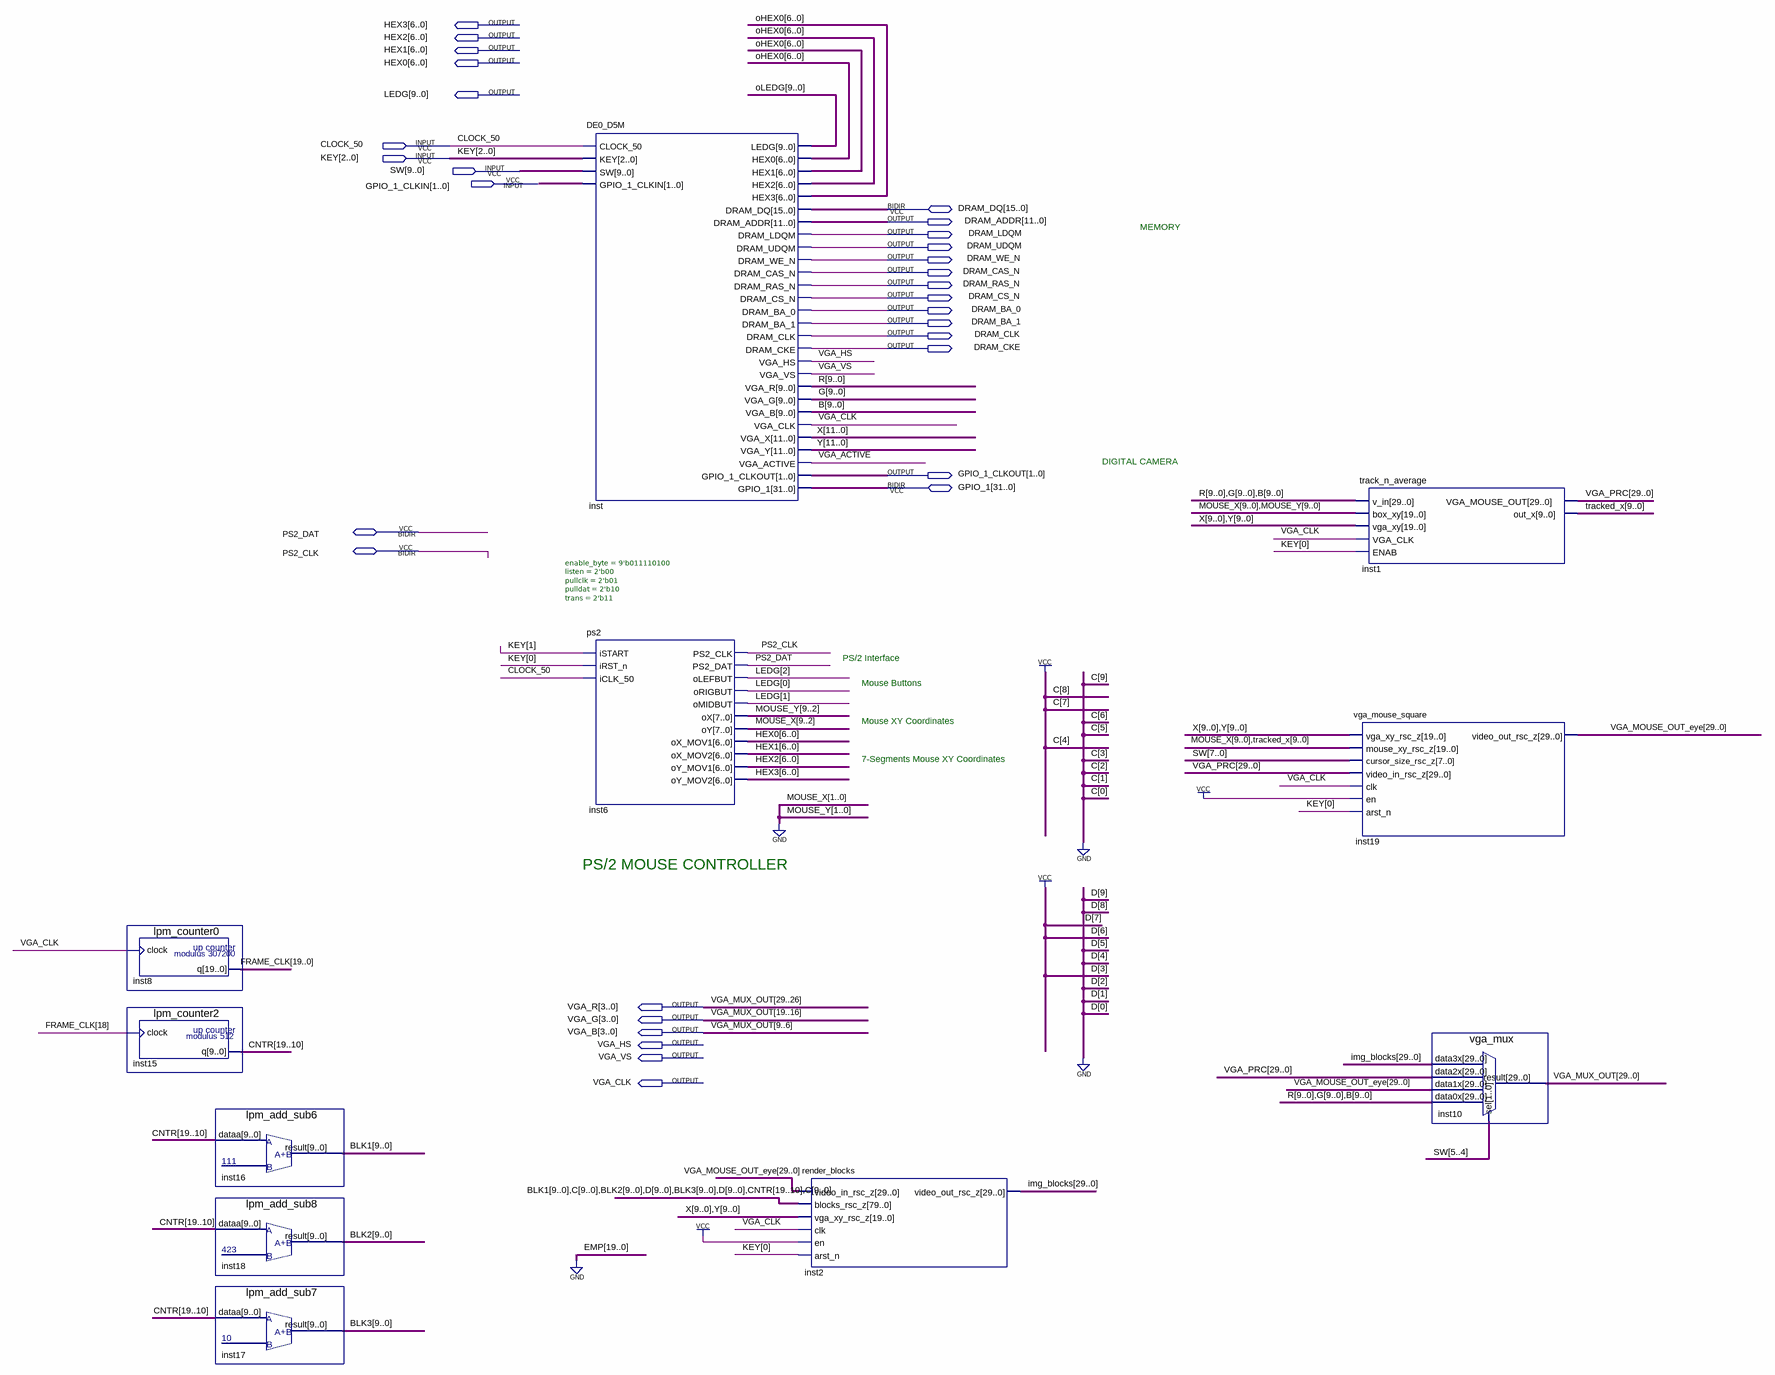
[diagram p0: schematic sheet]
// Quartus schematic TOP_DE0_CAMERA_MOUSE.bdf as structural Verilog: 11 symbols, 31 pins
module TOP_DE0_CAMERA_MOUSE (
  input  CLOCK_50,
  input  [2:0] KEY,
  input  [9:0] SW,
  input  [1:0] GPIO_1_CLKIN,
  inout  [15:0] DRAM_DQ,
  inout  [31:0] GPIO_1,
  inout  PS2_DAT,
  inout  PS2_CLK,
  output [6:0] HEX3,
  output [6:0] HEX2,
  output [6:0] HEX1,
  output [6:0] HEX0,
  output [9:0] LEDG,
  output [11:0] DRAM_ADDR,
  output DRAM_LDQM,
  output DRAM_UDQM,
  output DRAM_WE_N,
  output DRAM_CAS_N,
  output DRAM_RAS_N,
  output DRAM_CS_N,
  output DRAM_BA_0,
  output DRAM_BA_1,
  output DRAM_CLK,
  output DRAM_CKE,
  output [1:0] GPIO_1_CLKOUT,
  output [3:0] VGA_R,
  output [3:0] VGA_G,
  output [3:0] VGA_B,
  output VGA_HS,
  output VGA_VS,
  output VGA_CLK
);

  wire VGA_ACTIVE;
  wire [6:0] oHEX0;
  wire [9:0] B, BLK1, BLK2, BLK3, G, MOUSE_X, oLEDG, R, tracked_x;
  wire [9:2] MOUSE_Y;
  wire [11:0] X, Y;
  wire [19:0] FRAME_CLK;
  wire [19:10] CNTR;
  wire [25:0] VGA_MUX_OUT;
  wire [29:0] img_blocks, VGA_MOUSE_OUT_eye, VGA_PRC;

  lpm_counter0 inst8 (.clock(VGA_CLK), .q(FRAME_CLK));
  lpm_counter2 inst15 (.clock(FRAME_CLK[18]), .q(CNTR));
  lpm_add_sub6 inst16 (.dataa(CNTR), .result(BLK1));
  lpm_add_sub8 inst18 (.dataa(CNTR), .result(BLK2));
  lpm_add_sub7 inst17 (.dataa(CNTR), .result(BLK3));
  DE0_D5M inst (
    .CLOCK_50(CLOCK_50), .KEY(KEY), .SW(SW), .GPIO_1_CLKIN(GPIO_1_CLKIN), .LEDG(oLEDG), .HEX0(oHEX0),
    .HEX1(oHEX0), .HEX2(oHEX0), .HEX3(oHEX0), .DRAM_ADDR(DRAM_ADDR), .DRAM_LDQM(DRAM_LDQM),
    .DRAM_UDQM(DRAM_UDQM), .DRAM_WE_N(DRAM_WE_N), .DRAM_CAS_N(DRAM_CAS_N), .DRAM_RAS_N(DRAM_RAS_N),
    .DRAM_CS_N(DRAM_CS_N), .DRAM_BA_0(DRAM_BA_0), .DRAM_BA_1(DRAM_BA_1), .DRAM_CLK(DRAM_CLK),
    .DRAM_CKE(DRAM_CKE), .VGA_HS(VGA_HS), .VGA_VS(VGA_VS), .VGA_R(R), .VGA_G(G), .VGA_B(B),
    .VGA_CLK(VGA_CLK), .VGA_X(X), .VGA_Y(Y), .VGA_ACTIVE(VGA_ACTIVE), .GPIO_1_CLKOUT(GPIO_1_CLKOUT),
    .DRAM_DQ(DRAM_DQ), .GPIO_1(GPIO_1));
  ps2 #(.enable_byte(9'b011110100), .listen(2'b00), .pullclk(2'b01), .pulldat(2'b10), .trans(2'b11)) inst6 (
    .iSTART(KEY[1]), .iRST_n(KEY[0]), .iCLK_50(CLOCK_50), .oLEFBUT(LEDG[2]), .oRIGBUT(LEDG[0]),
    .oMIDBUT(LEDG[1]), .oX(MOUSE_Y), .oY(MOUSE_X[9:2]), .oX_MOV1(HEX0), .oX_MOV2(HEX1), .oY_MOV1(HEX2),
    .oY_MOV2(HEX3), .PS2_CLK(PS2_CLK), .PS2_DAT(PS2_DAT));
  render_blocks inst2 (
    .video_in_rsc_z(VGA_MOUSE_OUT_eye),
    .blocks_rsc_z({BLK1, 10'b0110010000, BLK2, 10'b0011001000, BLK3, 10'b0011001000, CNTR, 10'b0110010000}),
    .vga_xy_rsc_z({X[9:0], Y[9:0]}), .clk(VGA_CLK), .en(1'b1), .arst_n(KEY[0]), .video_out_rsc_z(img_blocks));
  track_n_average inst1 (
    .v_in({R, G, B}), .box_xy({MOUSE_X, MOUSE_Y, 2'b00}), .vga_xy({X[9:0], Y[9:0]}), .VGA_CLK(VGA_CLK),
    .ENAB(KEY[0]), .VGA_MOUSE_OUT(VGA_PRC), .out_x(tracked_x));
  vga_mouse_square inst19 (
    .vga_xy_rsc_z({X[9:0], Y[9:0]}), .mouse_xy_rsc_z({MOUSE_X, tracked_x}), .cursor_size_rsc_z(SW[7:0]),
    .video_in_rsc_z(VGA_PRC), .clk(VGA_CLK), .en(1'b1), .arst_n(KEY[0]), .video_out_rsc_z(VGA_MOUSE_OUT_eye));
  vga_mux inst10 (
    .data3x(img_blocks), .data2x(VGA_PRC), .data1x(VGA_MOUSE_OUT_eye), .data0x({R, G, B}), .sel(SW[5:4]),
    .result({VGA_R, VGA_MUX_OUT[25:20], VGA_G, VGA_MUX_OUT[15:10], VGA_B, VGA_MUX_OUT[5:0]}));

  // Other names for the same wires on the sheet: VGA_MUX_OUT (some bits) = {VGA_R, VGA_G, VGA_B}

  // Notes on the sheet:
  //   MEMORY
  //   DIGITAL CAMERA
  //   PS/2 Interface
  //   Mouse Buttons
  //   Mouse XY Coordinates
  //   7-Segments Mouse XY Coordinates
  //   PS/2 MOUSE CONTROLLER
endmodule
